# EAGLE design Voltage_Regulator (EAGLE 7.2.0)
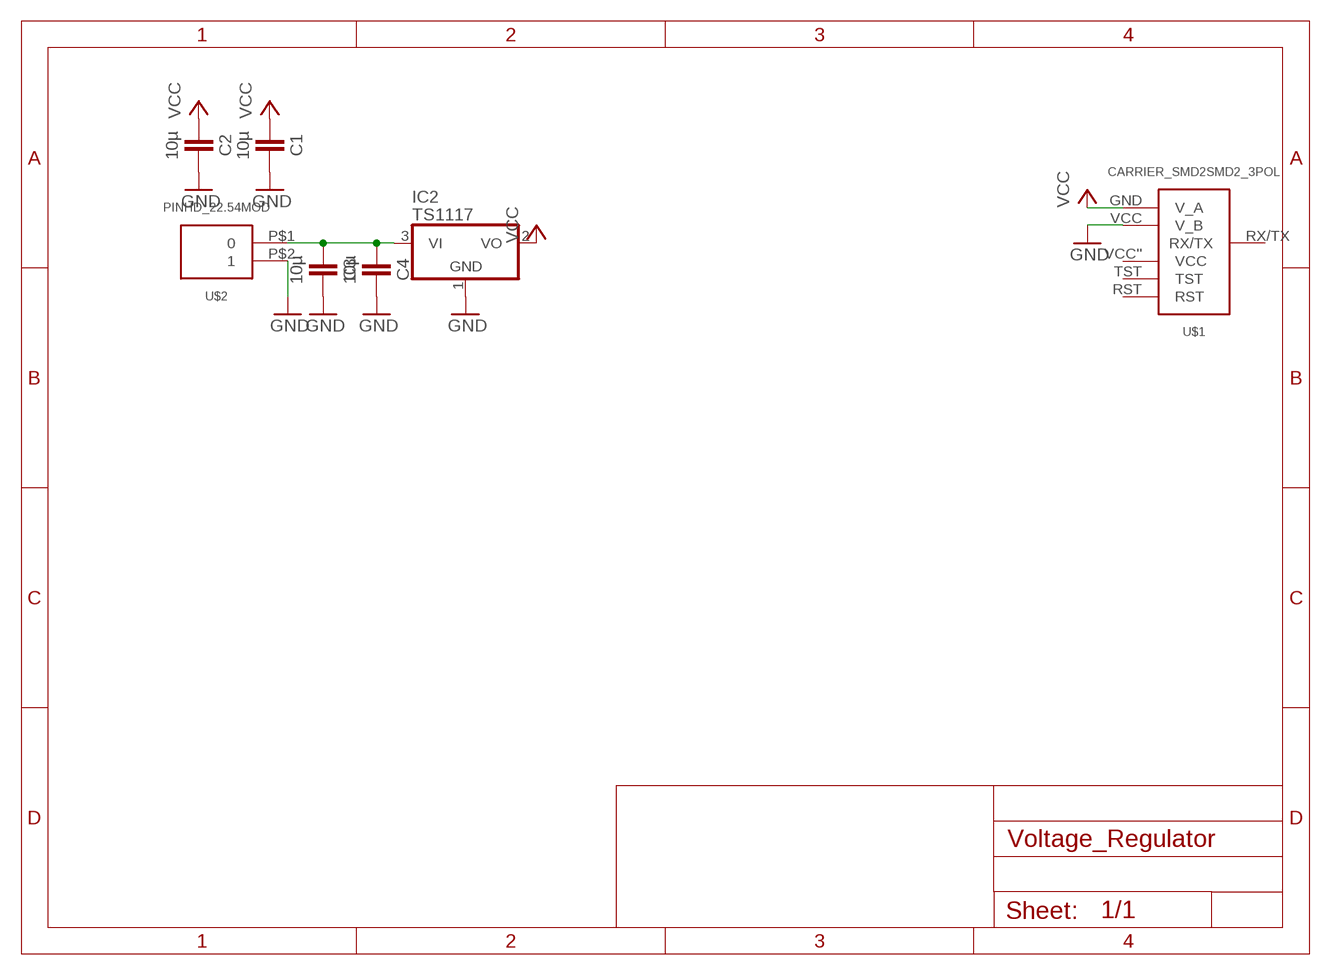
[diagram p0: schematic, sheet 1]

## Parts
C1  10µ  CAPACITOR1206  [1206]
C2  10µ  CAPACITOR1206  [1206]
C3  10µ  CAPACITOR1206  [1206]
C4  10µ  CAPACITOR1206  [1206]
IC2  TS1117  [SOT223]
U$1  CARRIER_SMD2SMD2_3POL  [CARRIER_SMD2_3POL]
U$2  PINHD_22.54MOD  [PINHD_2_MOD]

## Nets
GND: C1.2 C2.2 C3.2 C4.2 IC2.1(GND) U$1.VCC(V_B) U$2.P$2
N$2: C3.1 C4.1 IC2.3(VI) U$2.P$1
VCC: C1.1 C2.1 IC2.2(VO) U$1.GND(V_A)
Unconnected: U$1.RST U$1.RX/TX U$1.TST U$1.VCC''(VCC)

## Library data of the parts
C1-C4 = thar:CAPACITOR
IC2 = welectronic:TS1117
U$1 = thar:CARRIER_SMD2
U$2 = thar:PINHD_2

## Board
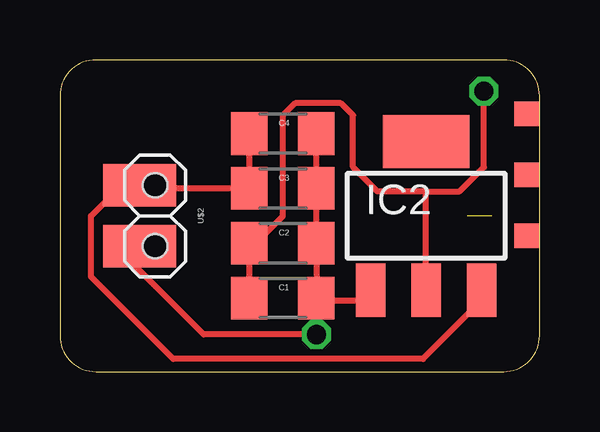
[diagram p1: board, top side]
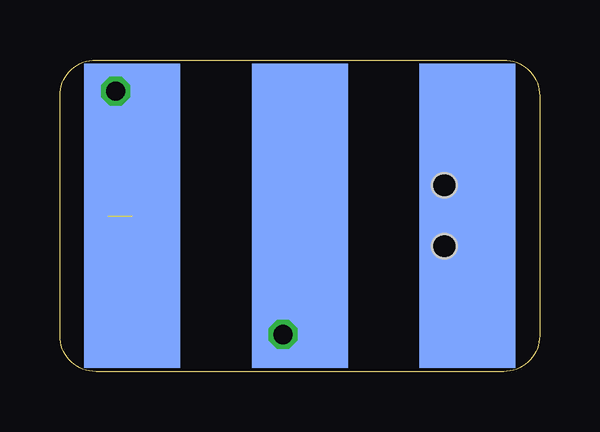
[diagram p2: board, bottom side, seen from below]

Size 20 x 13 mm. Coordinates in mm from the lower left corner, seen from the top.
Copper layers (1*16): Top 0.035mm / dielectric 1.5mm / Bottom 0.035mm
Design rules "Bilex DRU *": minimum track width 10mil, minimum drill 24mil, track to track 10mil, track to pad 10mil, pad to pad 10mil, via to via 10mil, smd to smd 10mil, copper to edge 1mil, drill to drill 8mil, minimum pad ring 10mil, minimum via ring 8mil, stop-mask expansion 4mil, vias tented up to drill 0mil, thermal gap 10mil

### Footprints (pad centres in the part's own frame; a part is rotated, then mirrored left to right if it is on the bottom)
1206 = smd 1.524 x 1.778: 1 -1.397,0; 2 1.397,0
SOT223 = smd 1.219 x 2.235: 1 -2.311,-3.099; 2 0,-3.099; 3 2.311,-3.099 | smd 3.6 x 2.2: 4 0,3.099
CARRIER_SMD2_3POL = smd 4 x 12.7 bottom: GND -6.985,0; RX/TX 6.985,0; VCC 0,0 | smd 1.016 x 1.016: RST -9.461,0.826; TST -9.461,-1.714; VCC'' -9.461,-4.255
PINHD_2_MOD = smd 1.778 x 3.048: P$1 -1.27,-0.635; P$2 1.27,-0.635 | hole 1.016: -1.27,0; 1.27,0

### Placement (x,y rotation side)
C1  9.3,3.07 0 top
C2  9.3,5.35 0 top
C3  9.3,7.64 0 top
C4  9.3,9.93 0 top
IC2  15.27,6.5 0 top
U$1  10,6.5 180 top
U$2  3.96,6.5 270 top

### Tracks (layer width: path | path; a pad name or v marks a point on that pad's centre or on a via)
GND  (via drill 0.8)
  Top 0.254: C2.2 C3.2 C4.2 10.19,10.18 10.31,10.31 10.31,10.43 | C2.2 C1.2 | C1.2 v10.7,1.54 6,1.54 2.82,4.72 U$2.P$2 | IC2.1 12.7,3.98 12.6,4.08 12.6,3.32 12.98,2.94 10.95,2.94 C1.2 | 10.82,5.23 C2.2 | 11.08,5.74 C2.2
  Bottom 0.406: U$1.VCC 10.7,6.5 v10.7,1.54
N$2
  Top 0.254: C3.1 C4.1 | 8.03,8.28 C3.1 | C3.1 7.52,7.13 7.52,7.64 | IC2.3 17.58,2.97 15.14,0.53 4.73,0.53 1.3,3.96 1.3,6.5 2.7,7.89 3.2,7.89 U$2.P$1 3.46,7.64 7.52,7.64 | 7.52,7.77 7.52,7.64
VCC  (via drill 0.8)  (1 unrouted)
  Top 0.254: C1.1 7.9,5.1 | 7.9,5.1 C2.1 | 7.9,5.1 9.3,6.5 9.3,10.69 9.81,11.2 11.71,11.2 12.22,10.69 12.22,8.53 13.24,7.51 15.27,7.51 | IC2.2 15.27,7.51 | 15.27,7.51 16.66,7.51 17.68,8.53 v17.68,11.7
  Bottom 0.254: v17.68,11.7 18.06,6.56 18,6.5